# Altium schematic sheet Ethernet-PoE-Sheet.SchDoc (part 3 of 3)
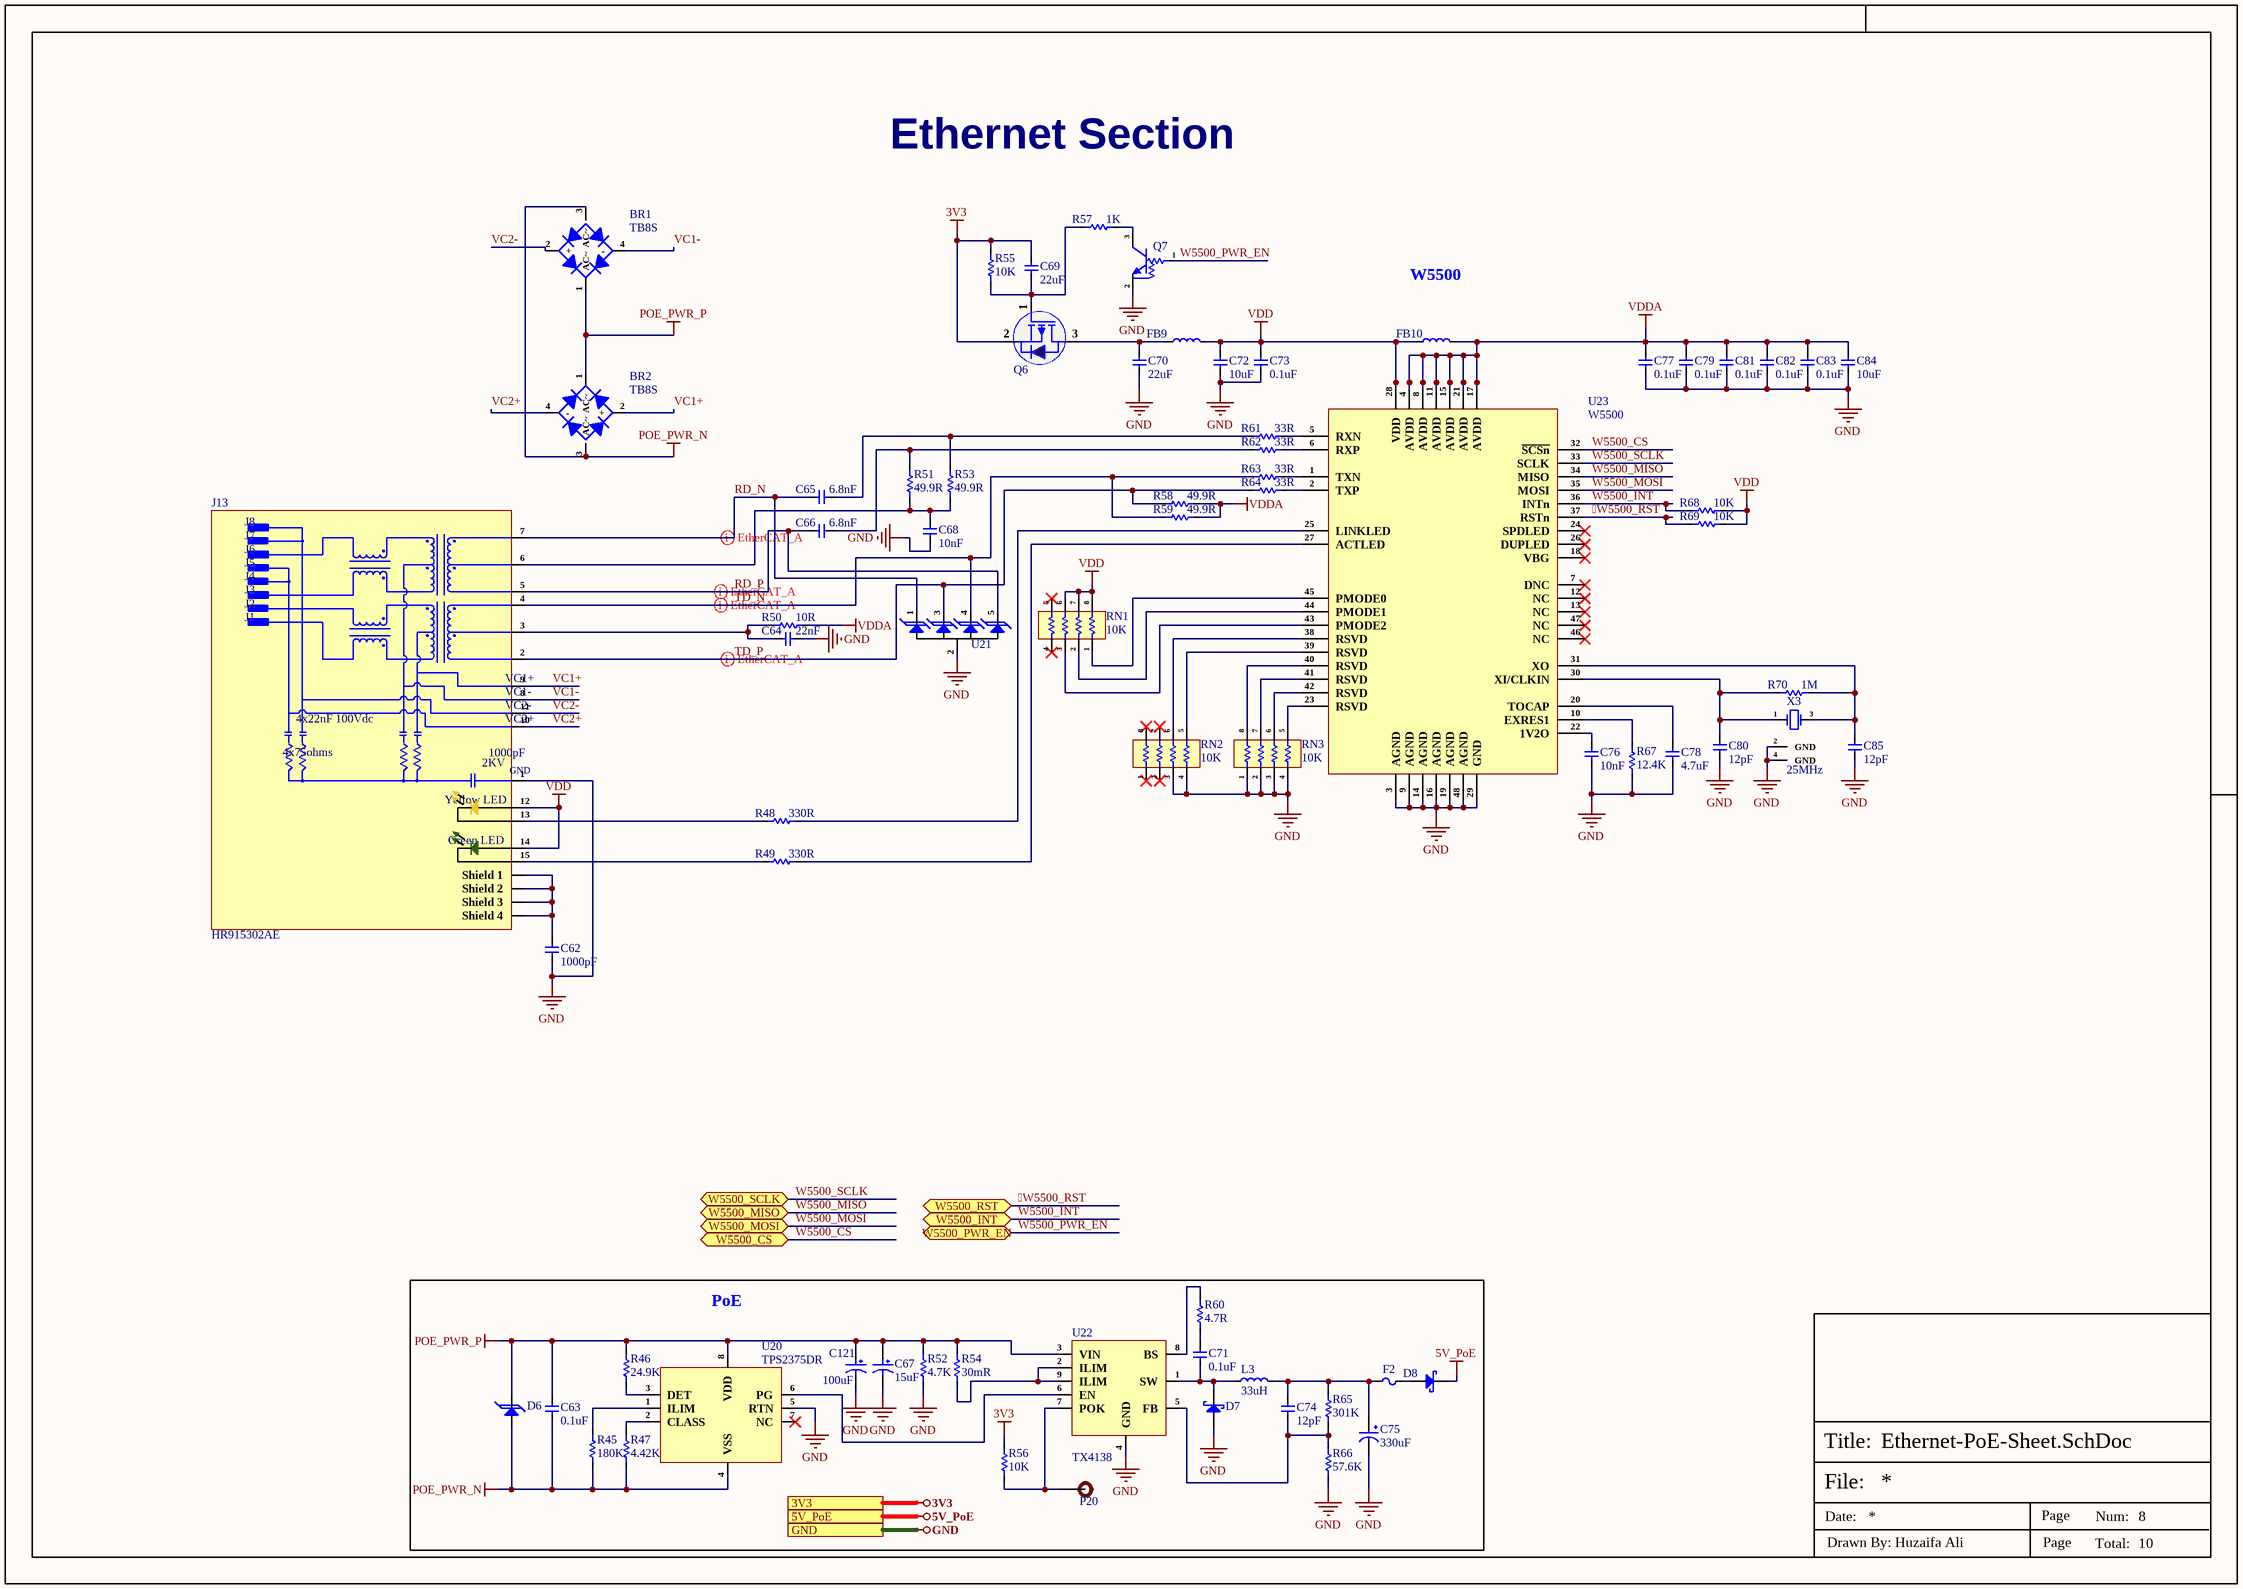
[diagram p2: Ethernet-PoE-Sheet.SchDoc]

## Library data of the parts (continued)
U21 = SP0504BAHTG: TVS DIODE 5.5VWM 8.5VC SOT23-5; Manufacturer: Littelfuse; Direction: Unidirectional; Value: 30pF; Number of Channels: 4; Polarity: Bidirectional,Unidirectional; Breakdown Voltage: 5.5V; Clamping Voltage: 7.8V; Max Power Dissipation: 225mW; Power Line Protection: No; Leakage Current: 100nA; ESD Protection: Yes; Voltage Rating (DC): 5V; Diode Type: ZENER; Clamping Voltage-Max: 8V; Supplier 1: Future Electronics; Manufacturer Part Number: SP0504BAHTG; RoHS: Yes; Category: TVS Diodes; Stock 1: 1611; Pricing 1: 1=0.78, 15=0.685, 75=0.625, 300=0.575, 1500=0.52 (USD); Mounting Technology: Surface Mount; Case/Package: SOT-23; Pins: 5; Min Operating Temperature: -40°C; Max Operating Temperature: 85°C; Packaging: Tape and Reel; Termination: SMD/SMT; Working Voltage: 5.5V; Number of Unidirectional Channels: 4; Reverse Standoff Voltage: 5.5V; Number of Elements: 4; Peak Pulse Power: 225mW; Max Reverse Leakage Current: 100nA; Power Dissipation: 225mW; Series: SP05, SPA®; Length: 3.05mm; Width: 1.75mm; Height: 1.3mm; Depth: 1.75mm; Radiation Hardening: No; Lead Free: Lead Free; RoHS Compliant: Yes; Reach SVHC Compliant: Unknown; ComponentLink1URL: https://datasheet.ciiva.com/15143/getdatasheetpartid-152299-15143806.pdf?src-supplier=Verical; ComponentLink1Description: https://datasheet.ciiva.com/15143/getdatasheetpartid-152299-15143806.pdf?src-supplier=Verical; ComponentLink2URL: https://datasheet.ciiva.com/4509/sp05x-leadfree-4509638.pdf?src-supplier=Mouser; ComponentLink2Description: https://datasheet.ciiva.com/4509/sp05x-leadfree-4509638.pdf?src-supplier=Mouser; ComponentLink3URL: https://datasheet.ciiva.com/22697/1911798-22697943.pdf?src-supplier=Element14; ComponentLink3Description: https://datasheet.ciiva.com/22697/1911798-22697943.pdf?src-supplier=Element14; ComponentLink4URL: https://datasheet.ciiva.com/8062/littefuse-spa-sp050x-8062425.pdf?src-supplier=Element14; ComponentLink4Description: https://datasheet.ciiva.com/8062/littefuse-spa-sp050x-8062425.pdf?src-supplier=Element14; ComponentLink5URL: https://datasheet.ciiva.com/332/sp05xxba-332619.pdf?src-supplier=Digi-Key; ComponentLink5Description: https://datasheet.ciiva.com/332/sp05xxba-332619.pdf?src-supplier=Digi-Key; ComponentLink6URL: https://datasheet.ciiva.com/332/sp05xxba-332620.pdf?src-supplier=Digi-Key; ComponentLink6Description: https://datasheet.ciiva.com/332/sp05xxba-332620.pdf?src-supplier=Digi-Key; ComponentLink7URL: https://datasheet.ciiva.com/16393/sp05xxba-16393404.pdf?src-supplier=Future+Electronics; ComponentLink7Description: https://datasheet.ciiva.com/16393/sp05xxba-16393404.pdf?src-supplier=Future+Electronics; ComponentLink8URL: https://datasheet.ciiva.com/332/sp05xxba-332621.pdf?src-supplier=Digi-Key; ComponentLink8Description: https://datasheet.ciiva.com/332/sp05xxba-332621.pdf?src-supplier=Digi-Key; ComponentLink9URL: https://datasheet.ciiva.com/1268/526672-1268494.pdf?src-supplier=Element14; ComponentLink9Description: https://datasheet.ciiva.com/1268/526672-1268494.pdf?src-supplier=Element14; Supplier Part Number 1: 3283009; LCSC Part Number: C10675; Item Type: TVS Diode
U22 = TX4138: Step-down type SOIC-8-EP DC-DC Converters ROHS; Manufacturer: XDS; Item Type: IC; Manufacturer Part Number: TX4138; Package: SOIC-8-EP; LCSC Part Number: C329267; ComponentLink1Description: LCSC; ComponentLink1URL: https://www.lcsc.com/product-detail/DC-DC-Converters_XDS-TX4138_C329267.html
U23 = W5500: SPI LQFP-48(7x7) Ethernet ICs ROHS; Manufacturer: WIZNET; Item Type: IC; Manufacturer Part Number: W5500; LCSC Part Number: C32843; Package: LQFP-48(7x7); ComponentLink1Description: LCSC; ComponentLink1URL: https://www.lcsc.com/product-detail/Ethernet-ICs_WIZNET-W5500_C32843.html
X3 = Q22FA12800090: CRYSTAL 25.0000MHZ 12PF SMD; Manufacturer: Seiko Epson; ComponentLink1Description: LCSC; ComponentLink1URL: https://www.lcsc.com/product-detail/Crystals_Seiko-Epson-Q22FA12800090_C255883.html; Manufacturer Part Number: Q22FA12800090; Package: SMD2016-4P; LCSC Part Number: C255883; Item Type: Crystal